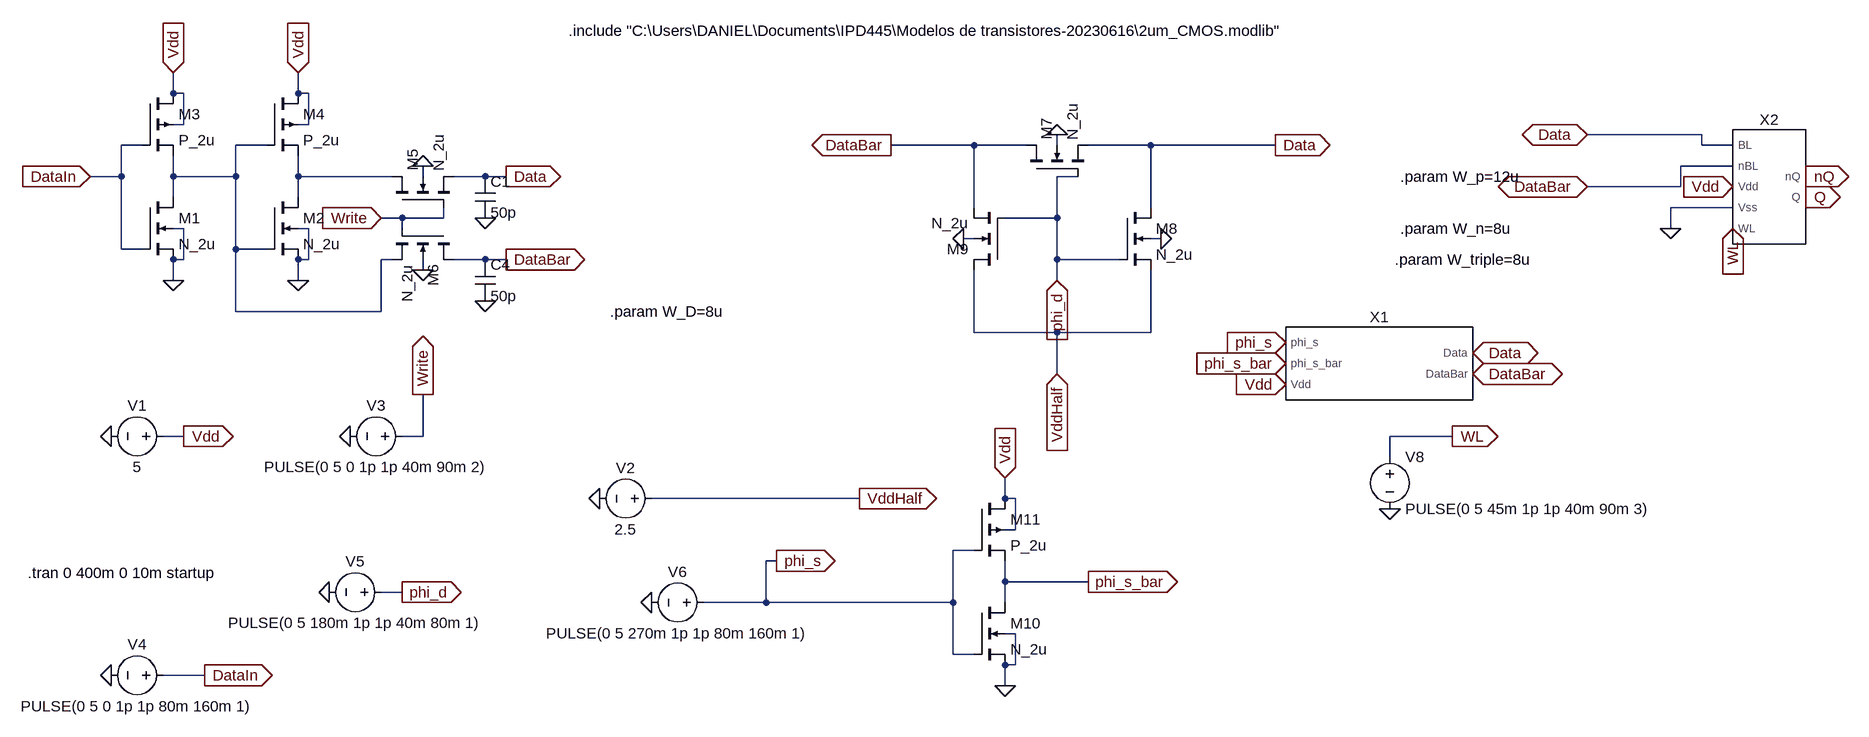
[diagram p0: schematic Drivers.asc]
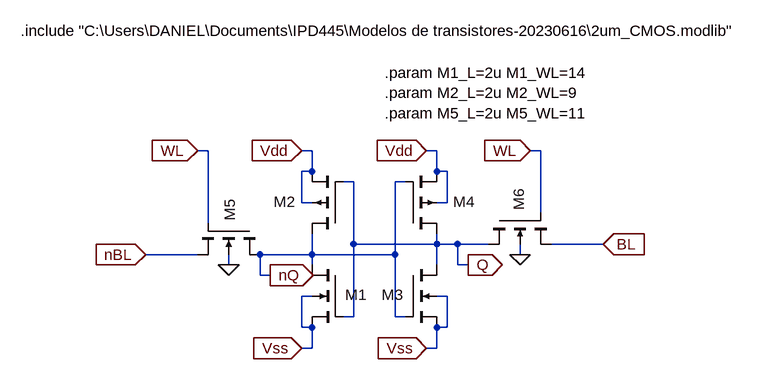
[diagram p1: sub-circuit core-final.asc]
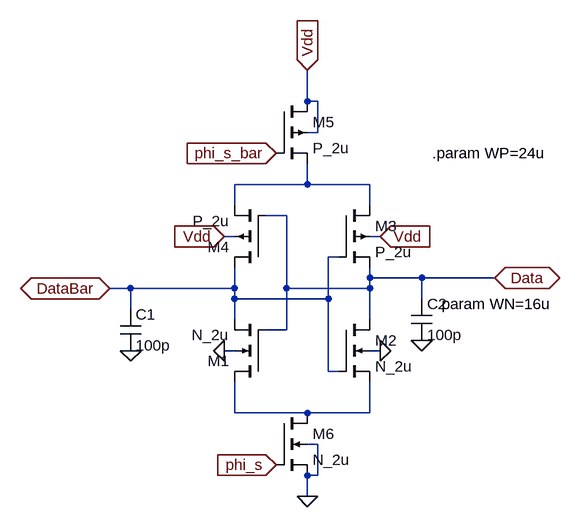
[diagram p2: sub-circuit amp.asc]
Drivers.asc, the LTspice schematic file:
Version 4
SHEET 1 2652 1000
WIRE 48 16 48 -16
WIRE 64 16 48 16
WIRE 240 16 240 -16
WIRE 256 16 240 16
WIRE 64 64 64 16
WIRE 64 64 48 64
WIRE 256 64 256 16
WIRE 256 64 240 64
WIRE 2400 80 2224 80
WIRE 0 96 -32 96
WIRE 192 96 144 96
WIRE 1280 96 1152 96
WIRE 1360 96 1280 96
WIRE 1408 96 1408 80
WIRE 1552 96 1456 96
WIRE 1744 96 1552 96
WIRE 2400 96 2400 80
WIRE 2448 96 2400 96
WIRE 2448 128 2368 128
WIRE -32 144 -32 96
WIRE -32 144 -80 144
WIRE 48 144 48 112
WIRE 144 144 144 96
WIRE 144 144 48 144
WIRE 240 144 240 112
WIRE 384 144 240 144
WIRE 432 144 432 128
WIRE 528 144 480 144
WIRE 560 144 528 144
WIRE 1440 144 1408 144
WIRE 2368 160 2368 128
WIRE 2368 160 2224 160
WIRE 48 176 48 144
WIRE 240 176 240 144
WIRE 1280 192 1280 96
WIRE 1552 192 1552 96
WIRE 2448 192 2352 192
WIRE 400 208 368 208
WIRE 464 208 464 192
WIRE 464 208 400 208
WIRE 1408 208 1408 144
WIRE 1408 208 1328 208
WIRE 64 224 48 224
WIRE 256 224 240 224
WIRE 400 224 400 208
WIRE 2352 224 2352 192
WIRE 1280 240 1264 240
WIRE 1568 240 1552 240
WIRE -32 256 -32 144
WIRE 0 256 -32 256
WIRE 144 256 144 144
WIRE 192 256 144 256
WIRE 64 272 64 224
WIRE 64 272 48 272
WIRE 256 272 256 224
WIRE 256 272 240 272
WIRE 384 272 368 272
WIRE 528 272 480 272
WIRE 560 272 528 272
WIRE 1408 272 1408 208
WIRE 1504 272 1408 272
WIRE 432 288 432 272
WIRE 48 304 48 272
WIRE 240 304 240 272
WIRE 1408 304 1408 272
WIRE 144 352 144 256
WIRE 368 352 368 272
WIRE 368 352 144 352
WIRE 1280 384 1280 288
WIRE 1408 384 1280 384
WIRE 1552 384 1552 288
WIRE 1552 384 1408 384
WIRE 1408 448 1408 384
WIRE 64 544 32 544
WIRE 432 544 432 480
WIRE 432 544 400 544
WIRE 2016 544 1920 544
WIRE 1920 576 1920 544
WIRE 1104 640 784 640
WIRE 1328 640 1328 608
WIRE 1344 640 1328 640
WIRE 1344 688 1344 640
WIRE 1344 688 1328 688
WIRE 1280 720 1248 720
WIRE 976 736 960 736
WIRE 1328 768 1328 736
WIRE 1456 768 1328 768
WIRE 400 784 368 784
WIRE 960 800 960 736
WIRE 960 800 864 800
WIRE 1248 800 1248 720
WIRE 1248 800 960 800
WIRE 1328 800 1328 768
WIRE 1344 848 1328 848
WIRE 1248 880 1248 800
WIRE 1280 880 1248 880
WIRE 1344 896 1344 848
WIRE 1344 896 1328 896
WIRE 96 912 32 912
WIRE 1328 928 1328 896
FLAG 48 304 0
FLAG 240 304 0
FLAG 48 -16 Vdd
IOPIN 48 -16 In
FLAG 240 -16 Vdd
IOPIN 240 -16 In
FLAG -80 144 DataIn
IOPIN -80 144 In
FLAG 1408 448 VddHalf
IOPIN 1408 448 In
FLAG 1408 304 phi_d
IOPIN 1408 304 In
FLAG -48 544 0
FLAG 704 640 0
FLAG 64 544 Vdd
IOPIN 64 544 Out
FLAG 1104 640 VddHalf
IOPIN 1104 640 Out
FLAG 320 544 0
FLAG 432 480 Write
IOPIN 432 480 Out
FLAG -48 912 0
FLAG 96 912 DataIn
IOPIN 96 912 Out
FLAG 288 784 0
FLAG 400 784 phi_d
IOPIN 400 784 Out
FLAG 784 800 0
FLAG 976 736 phi_s
IOPIN 976 736 Out
FLAG 1456 768 phi_s_bar
IOPIN 1456 768 Out
FLAG 2448 224 WL
IOPIN 2448 224 In
FLAG 2224 80 Data
IOPIN 2224 80 BiDir
FLAG 2224 160 DataBar
IOPIN 2224 160 BiDir
FLAG 2448 160 Vdd
IOPIN 2448 160 In
FLAG 2352 224 0
FLAG 2560 144 nQ
IOPIN 2560 144 Out
FLAG 2560 176 Q
IOPIN 2560 176 Out
FLAG 1920 656 0
FLAG 2016 544 WL
IOPIN 2016 544 Out
FLAG 368 208 Write
IOPIN 368 208 In
FLAG 560 144 Data
IOPIN 560 144 Out
FLAG 560 272 DataBar
IOPIN 560 272 Out
FLAG 1152 96 DataBar
IOPIN 1152 96 Out
FLAG 1744 96 Data
IOPIN 1744 96 Out
FLAG 528 208 0
FLAG 528 336 0
FLAG 432 288 0
FLAG 432 128 0
FLAG 1264 240 0
FLAG 1408 80 0
FLAG 1568 240 0
FLAG 1760 464 Vdd
IOPIN 1760 464 In
FLAG 2048 416 Data
IOPIN 2048 416 BiDir
FLAG 2048 448 DataBar
IOPIN 2048 448 BiDir
FLAG 1328 928 0
FLAG 1328 608 Vdd
IOPIN 1328 608 In
FLAG 1760 400 phi_s
IOPIN 1760 400 In
FLAG 1760 432 phi_s_bar
IOPIN 1760 432 In
SYMBOL nmos4 0 176 R0
SYMATTR InstName M1
SYMATTR Value N_2u
SYMATTR Value2 l=2u w={W_n}
SYMBOL nmos4 192 176 R0
SYMATTR InstName M2
SYMATTR Value N_2u
SYMATTR Value2 l=2u w={W_n}
SYMBOL pmos4 0 16 R0
SYMATTR InstName M3
SYMATTR Value P_2u
SYMATTR Value2 l=2u w={W_p}
SYMBOL pmos4 192 16 R0
SYMATTR InstName M4
SYMATTR Value P_2u
SYMATTR Value2 l=2u w={W_p}
SYMBOL nmos4 384 192 R270
SYMATTR InstName M5
SYMATTR Value N_2u
SYMATTR Value2 l=2u w={W_D}
SYMBOL nmos4 1360 144 R270
SYMATTR InstName M7
SYMATTR Value N_2u
SYMATTR Value2 l=2u w={W_triple}
SYMBOL nmos4 1504 192 R0
SYMATTR InstName M8
SYMATTR Value N_2u
SYMATTR Value2 l=2u w={W_triple}
SYMBOL voltage 48 544 R90
WINDOW 0 -32 56 VBottom 2
WINDOW 3 32 56 VTop 2
WINDOW 123 0 0 Left 0
WINDOW 39 0 0 Left 0
SYMATTR InstName V1
SYMATTR Value 5
SYMBOL voltage 800 640 R90
WINDOW 0 -32 56 VBottom 2
WINDOW 3 32 56 VTop 2
WINDOW 123 0 0 Left 0
WINDOW 39 0 0 Left 0
SYMATTR InstName V2
SYMATTR Value 2.5
SYMBOL voltage 416 544 R90
WINDOW 0 -32 56 VBottom 2
WINDOW 3 32 56 VTop 2
WINDOW 123 0 0 Left 0
WINDOW 39 0 0 Left 0
SYMATTR InstName V3
SYMATTR Value PULSE(0 5 0 1p 1p 40m 90m 2)
SYMBOL voltage 48 912 R90
WINDOW 0 -32 56 VBottom 2
WINDOW 3 32 56 VTop 2
WINDOW 123 0 0 Left 0
WINDOW 39 0 0 Left 0
SYMATTR InstName V4
SYMATTR Value PULSE(0 5 0 1p 1p 80m 160m 1)
SYMBOL voltage 384 784 R90
WINDOW 0 -32 56 VBottom 2
WINDOW 3 32 56 VTop 2
WINDOW 123 0 0 Left 0
WINDOW 39 0 0 Left 0
SYMATTR InstName V5
SYMATTR Value PULSE(0 5 180m 1p 1p 40m 80m 1)
SYMBOL nmos4 1328 288 R180
SYMATTR InstName M9
SYMATTR Value N_2u
SYMATTR Value2 l=2u w={W_triple}
SYMBOL nmos4 480 224 R90
SYMATTR InstName M6
SYMATTR Value N_2u
SYMATTR Value2 l=2u w={W_D}
SYMBOL voltage 880 800 R90
WINDOW 0 -32 56 VBottom 2
WINDOW 3 32 56 VTop 2
WINDOW 123 0 0 Left 0
WINDOW 39 0 0 Left 0
SYMATTR InstName V6
SYMATTR Value PULSE(0 5 270m 1p 1p 80m 160m 1)
SYMBOL core-final 2496 160 R0
SYMATTR InstName X2
SYMBOL voltage 1920 560 R0
WINDOW 123 0 0 Left 0
WINDOW 39 0 0 Left 0
SYMATTR InstName V8
SYMATTR Value PULSE(0 5 45m 1p 1p 40m 90m 3)
SYMBOL cap 512 144 R0
SYMATTR InstName C1
SYMATTR Value 50p
SYMBOL cap 512 272 R0
SYMATTR InstName C4
SYMATTR Value 50p
SYMBOL amp 1904 432 R0
SYMATTR InstName X1
SYMBOL nmos4 1280 800 R0
SYMATTR InstName M10
SYMATTR Value N_2u
SYMATTR Value2 l=2u w={W_n}
SYMBOL pmos4 1280 640 R0
SYMATTR InstName M11
SYMATTR Value P_2u
SYMATTR Value2 l=2u w={W_p}
TEXT 656 -80 Left 2 !.include "C:\\Users\\DANIEL\\Documents\\IPD445\\Modelos de transistores-20230616\\2um_CMOS.modlib"
TEXT -176 754 Left 2 !.tran 0 400m 0 10m startup
TEXT 1936 144 Left 2 !.param W_p=12u
TEXT 1936 224 Left 2 !.param W_n=8u
TEXT 720 352 Left 2 !.param W_D=8u
TEXT 1928 272 Left 2 !.param W_triple=8u

core-final.asc, the sub-circuit schematic file:
Version 4
SHEET 1 1180 1172
WIRE -560 112 -576 112
WIRE -400 112 -416 112
WIRE -208 112 -224 112
WIRE -48 112 -64 112
WIRE -400 144 -400 112
WIRE -400 144 -416 144
WIRE -208 144 -208 112
WIRE -192 144 -208 144
WIRE -336 160 -352 160
WIRE -256 160 -272 160
WIRE -416 192 -416 144
WIRE -400 192 -416 192
WIRE -192 192 -192 144
WIRE -192 192 -208 192
WIRE -48 208 -48 112
WIRE -560 224 -560 112
WIRE -336 256 -336 160
WIRE -208 256 -208 240
WIRE -208 256 -336 256
WIRE -176 256 -208 256
WIRE -128 256 -176 256
WIRE 48 256 -32 256
WIRE -576 272 -656 272
WIRE -400 272 -400 240
WIRE -400 272 -480 272
WIRE -272 272 -272 160
WIRE -272 272 -400 272
WIRE -80 272 -80 256
WIRE -528 288 -528 272
WIRE -400 288 -400 272
WIRE -208 288 -208 256
WIRE -176 288 -176 256
WIRE -160 288 -176 288
WIRE -480 304 -480 272
WIRE -464 304 -480 304
WIRE -400 336 -416 336
WIRE -192 336 -208 336
WIRE -336 368 -336 256
WIRE -336 368 -352 368
WIRE -272 368 -272 272
WIRE -256 368 -272 368
WIRE -416 384 -416 336
WIRE -400 384 -416 384
WIRE -192 384 -192 336
WIRE -192 384 -208 384
WIRE -400 416 -400 384
WIRE -400 416 -416 416
WIRE -208 416 -208 384
WIRE -208 416 -224 416
FLAG -416 416 Vss
IOPIN -416 416 In
FLAG -656 272 nBL
IOPIN -656 272 In
FLAG 48 256 BL
IOPIN 48 256 In
FLAG -576 112 WL
IOPIN -576 112 In
FLAG -64 112 WL
IOPIN -64 112 In
FLAG -416 112 Vdd
IOPIN -416 112 In
FLAG -224 112 Vdd
IOPIN -224 112 In
FLAG -464 304 nQ
IOPIN -464 304 Out
FLAG -160 288 Q
IOPIN -160 288 Out
FLAG -224 416 Vss
IOPIN -224 416 In
FLAG -528 288 0
FLAG -80 272 0
SYMBOL pmos4 -352 240 R180
WINDOW 0 73 49 Left 2
WINDOW 3 55 45 Invisible 2
SYMATTR InstName M2
SYMATTR Value P_2u
SYMATTR Value2 l={M2_L} w={M2_L * M2_WL}
SYMBOL nmos4 -352 288 M0
WINDOW 0 -37 46 Left 2
WINDOW 3 -70 42 Invisible 2
SYMATTR InstName M1
SYMATTR Value N_2u
SYMATTR Value2 l={M1_L} w={M1_L * M1_WL}
SYMBOL pmos4 -256 240 M180
WINDOW 0 73 49 Left 2
WINDOW 3 55 45 Invisible 2
SYMATTR InstName M4
SYMATTR Value P_2u
SYMATTR Value2 l={M2_L} w={M2_L * M2_WL}
SYMBOL nmos4 -256 288 R0
WINDOW 0 -37 46 Left 2
WINDOW 3 -70 42 Invisible 2
SYMATTR InstName M3
SYMATTR Value N_2u
SYMATTR Value2 l={M1_L} w={M1_L * M1_WL}
SYMBOL nmos4 -480 224 R90
WINDOW 0 -37 46 Left 2
WINDOW 3 -70 42 Invisible 2
SYMATTR InstName M5
SYMATTR Value N_2u
SYMATTR Value2 l={M5_L} w={M5_L * M5_WL}
SYMBOL nmos4 -128 208 M90
WINDOW 0 -37 46 Left 2
WINDOW 3 -70 42 Invisible 2
SYMATTR InstName M6
SYMATTR Value N_2u
SYMATTR Value2 l={M5_L} w={M5_L * M5_WL}
TEXT -848 -72 Left 2 !.include "C:\\Users\\DANIEL\\Documents\\IPD445\\Modelos de transistores-20230616\\2um_CMOS.modlib"
TEXT -288 -8 Left 2 !.param M1_L=2u M1_WL=14\n.param M2_L=2u M2_WL=9\n.param M5_L=2u M5_WL=11

amp.asc, the sub-circuit schematic file:
Version 4
SHEET 1 880 680
WIRE 176 -144 176 -192
WIRE 192 -144 176 -144
WIRE 192 -96 192 -144
WIRE 192 -96 176 -96
WIRE 176 -16 176 -48
WIRE 176 -16 64 -16
WIRE 272 -16 176 -16
WIRE 64 16 64 -16
WIRE 272 16 272 -16
WIRE 144 32 112 32
WIRE 64 64 48 64
WIRE 288 64 272 64
WIRE 224 96 208 96
WIRE 272 128 272 112
WIRE 352 128 272 128
WIRE 464 128 352 128
WIRE -96 144 -128 144
WIRE 64 144 64 112
WIRE 64 144 -96 144
WIRE 144 144 144 32
WIRE 272 144 272 128
WIRE 272 144 144 144
WIRE 64 160 64 144
WIRE 208 160 208 96
WIRE 208 160 64 160
WIRE 352 160 352 128
WIRE -96 176 -96 144
WIRE 64 192 64 160
WIRE 272 192 272 144
WIRE 144 208 144 144
WIRE 144 208 112 208
WIRE 64 240 48 240
WIRE 288 240 272 240
WIRE 208 272 208 160
WIRE 224 272 208 272
WIRE 64 336 64 288
WIRE 176 336 64 336
WIRE 272 336 272 288
WIRE 272 336 176 336
WIRE 192 384 176 384
WIRE 192 432 192 384
WIRE 192 432 176 432
WIRE 176 464 176 432
FLAG 176 -192 Vdd
IOPIN 176 -192 In
FLAG 128 -64 phi_s_bar
IOPIN 128 -64 In
FLAG 128 416 phi_s
IOPIN 128 416 In
FLAG 176 464 0
FLAG -128 144 DataBar
IOPIN -128 144 BiDir
FLAG 464 128 Data
IOPIN 464 128 BiDir
FLAG 288 64 Vdd
IOPIN 288 64 In
FLAG 48 64 Vdd
IOPIN 48 64 In
FLAG 288 240 0
FLAG 48 240 0
FLAG -96 240 0
FLAG 352 224 0
SYMBOL nmos4 112 288 R180
SYMATTR InstName M1
SYMATTR Value N_2u
SYMATTR Value2 l=2u w={WN}
SYMBOL nmos4 224 192 R0
SYMATTR InstName M2
SYMATTR Value N_2u
SYMATTR Value2 l=2u w={WN}
SYMBOL pmos4 224 16 R0
SYMATTR InstName M3
SYMATTR Value P_2u
SYMATTR Value2 l=2u w={WP}
SYMBOL pmos4 112 112 R180
SYMATTR InstName M4
SYMATTR Value P_2u
SYMATTR Value2 l=2u w={WP}
SYMBOL pmos4 128 -144 R0
SYMATTR InstName M5
SYMATTR Value P_2u
SYMATTR Value2 l=2u w={WP}
SYMBOL nmos4 128 336 R0
SYMATTR InstName M6
SYMATTR Value N_2u
SYMATTR Value2 l=2u w={WN}
SYMBOL cap -112 176 R0
SYMATTR InstName C1
SYMATTR Value 100p
SYMBOL cap 336 160 R0
SYMATTR InstName C2
SYMATTR Value 100p
TEXT 368 -64 Left 2 !.param WP=24u
TEXT 376 168 Left 2 !.param WN=16u

The netlist it stands for:
* Drivers.asc
M1 N001 DataIn 0 0 N_2u l=2u w={W_n}
M2 N002 N001 0 0 N_2u l=2u w={W_n}
M3 Vdd DataIn N001 Vdd P_2u l=2u w={W_p}
M4 Vdd N001 N002 Vdd P_2u l=2u w={W_p}
M5 N002 Write Data 0 N_2u l=2u w={W_D}
M7 DataBar phi_d Data 0 N_2u l=2u w={W_triple}
M8 Data phi_d VddHalf 0 N_2u l=2u w={W_triple}
V1 Vdd 0 5
V2 VddHalf 0 2.5
V3 Write 0 PULSE(0 5 0 1p 1p 40m 90m 2)
V4 DataIn 0 PULSE(0 5 0 1p 1p 80m 160m 1)
V5 phi_d 0 PULSE(0 5 180m 1p 1p 40m 80m 1)
M9 VddHalf phi_d DataBar 0 N_2u l=2u w={W_triple}
M6 DataBar Write N001 0 N_2u l=2u w={W_D}
V6 phi_s 0 PULSE(0 5 270m 1p 1p 80m 160m 1)
XX2 Data DataBar Vdd 0 WL nQ Q core-final
V8 WL 0 PULSE(0 5 45m 1p 1p 40m 90m 3)
C1 Data 0 50p
C4 DataBar 0 50p
XX1 phi_s phi_s_bar Vdd Data DataBar amp
M10 phi_s_bar phi_s 0 0 N_2u l=2u w={W_n}
M11 Vdd phi_s phi_s_bar Vdd P_2u l=2u w={W_p}

* block symbol definitions
.subckt core-final BL nBL Vdd Vss WL nQ Q
M2 nQ Q Vdd Vdd P_2u l={M2_L} w={M2_L * M2_WL}
M1 nQ Q Vss Vss N_2u l={M1_L} w={M1_L * M1_WL}
M4 Q nQ Vdd Vdd P_2u l={M2_L} w={M2_L * M2_WL}
M3 Q nQ Vss Vss N_2u l={M1_L} w={M1_L * M1_WL}
M5 nQ WL nBL 0 N_2u l={M5_L} w={M5_L * M5_WL}
M6 Q WL BL 0 N_2u l={M5_L} w={M5_L * M5_WL}
.include "C:\Users\DANIEL\Documents\IPD445\Modelos de transistores-20230616\2um_CMOS.modlib"
.param M1_L=2u M1_WL=14
.param M2_L=2u M2_WL=9
.param M5_L=2u M5_WL=11
.ends core-final

.subckt amp phi_s phi_s_bar Vdd Data DataBar
M1 N002 Data DataBar 0 N_2u l=2u w={WN}
M2 Data DataBar N002 0 N_2u l=2u w={WN}
M3 N001 DataBar Data Vdd P_2u l=2u w={WP}
M4 DataBar Data N001 Vdd P_2u l=2u w={WP}
M5 Vdd phi_s_bar N001 Vdd P_2u l=2u w={WP}
M6 N002 phi_s 0 0 N_2u l=2u w={WN}
C1 DataBar 0 100p
C2 Data 0 100p
.param WP=24u
.param WN=16u
.ends amp

.model NMOS NMOS
.model PMOS PMOS
.lib standard.mos
.include "C:\Users\DANIEL\Documents\IPD445\Modelos de transistores-20230616\2um_CMOS.modlib"
.tran 0 400m 0 10m startup
.param W_p=12u
.param W_n=8u
.param W_D=8u
.param W_triple=8u
.backanno
.end